# EAGLE board Arduhub_plane (EAGLE 7.3.0)
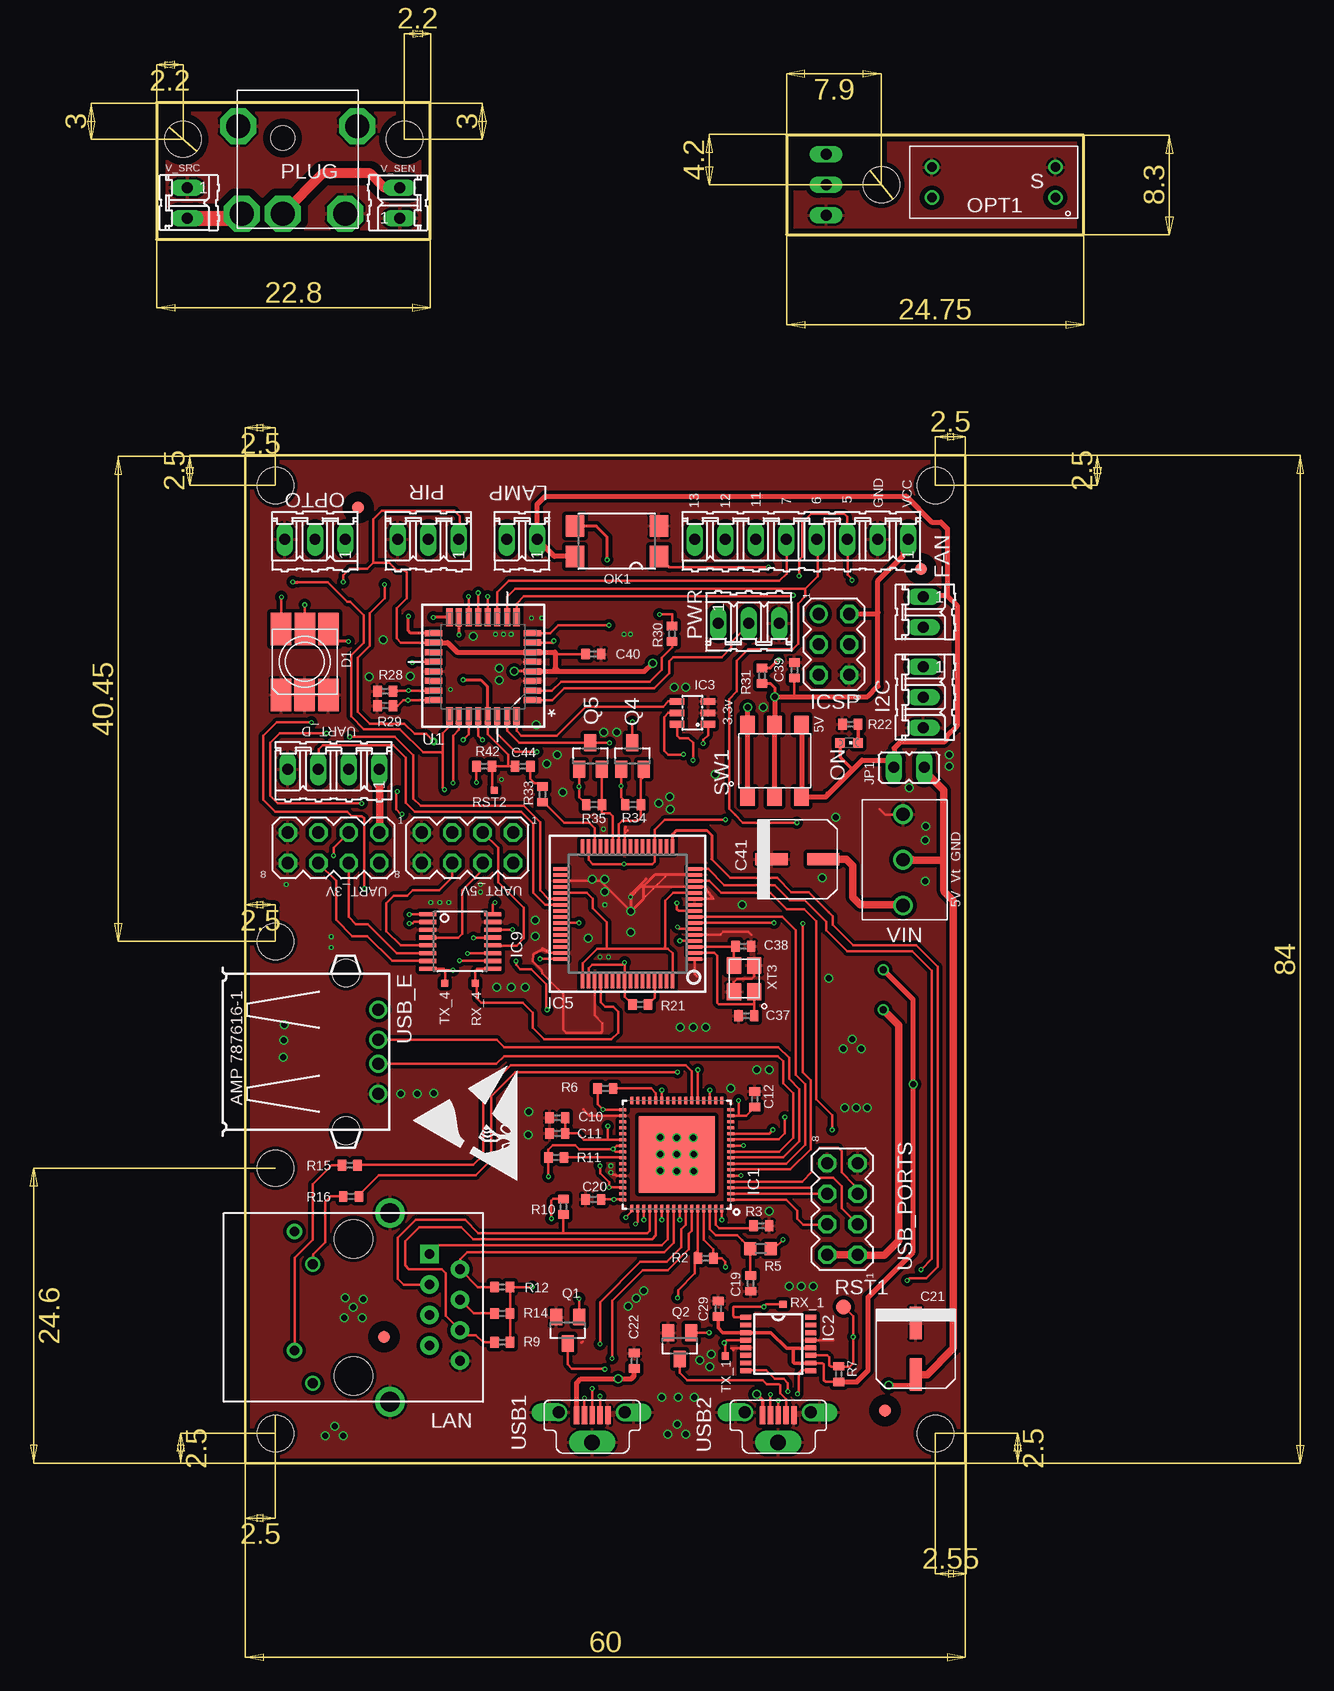
[diagram p3: board, top side]
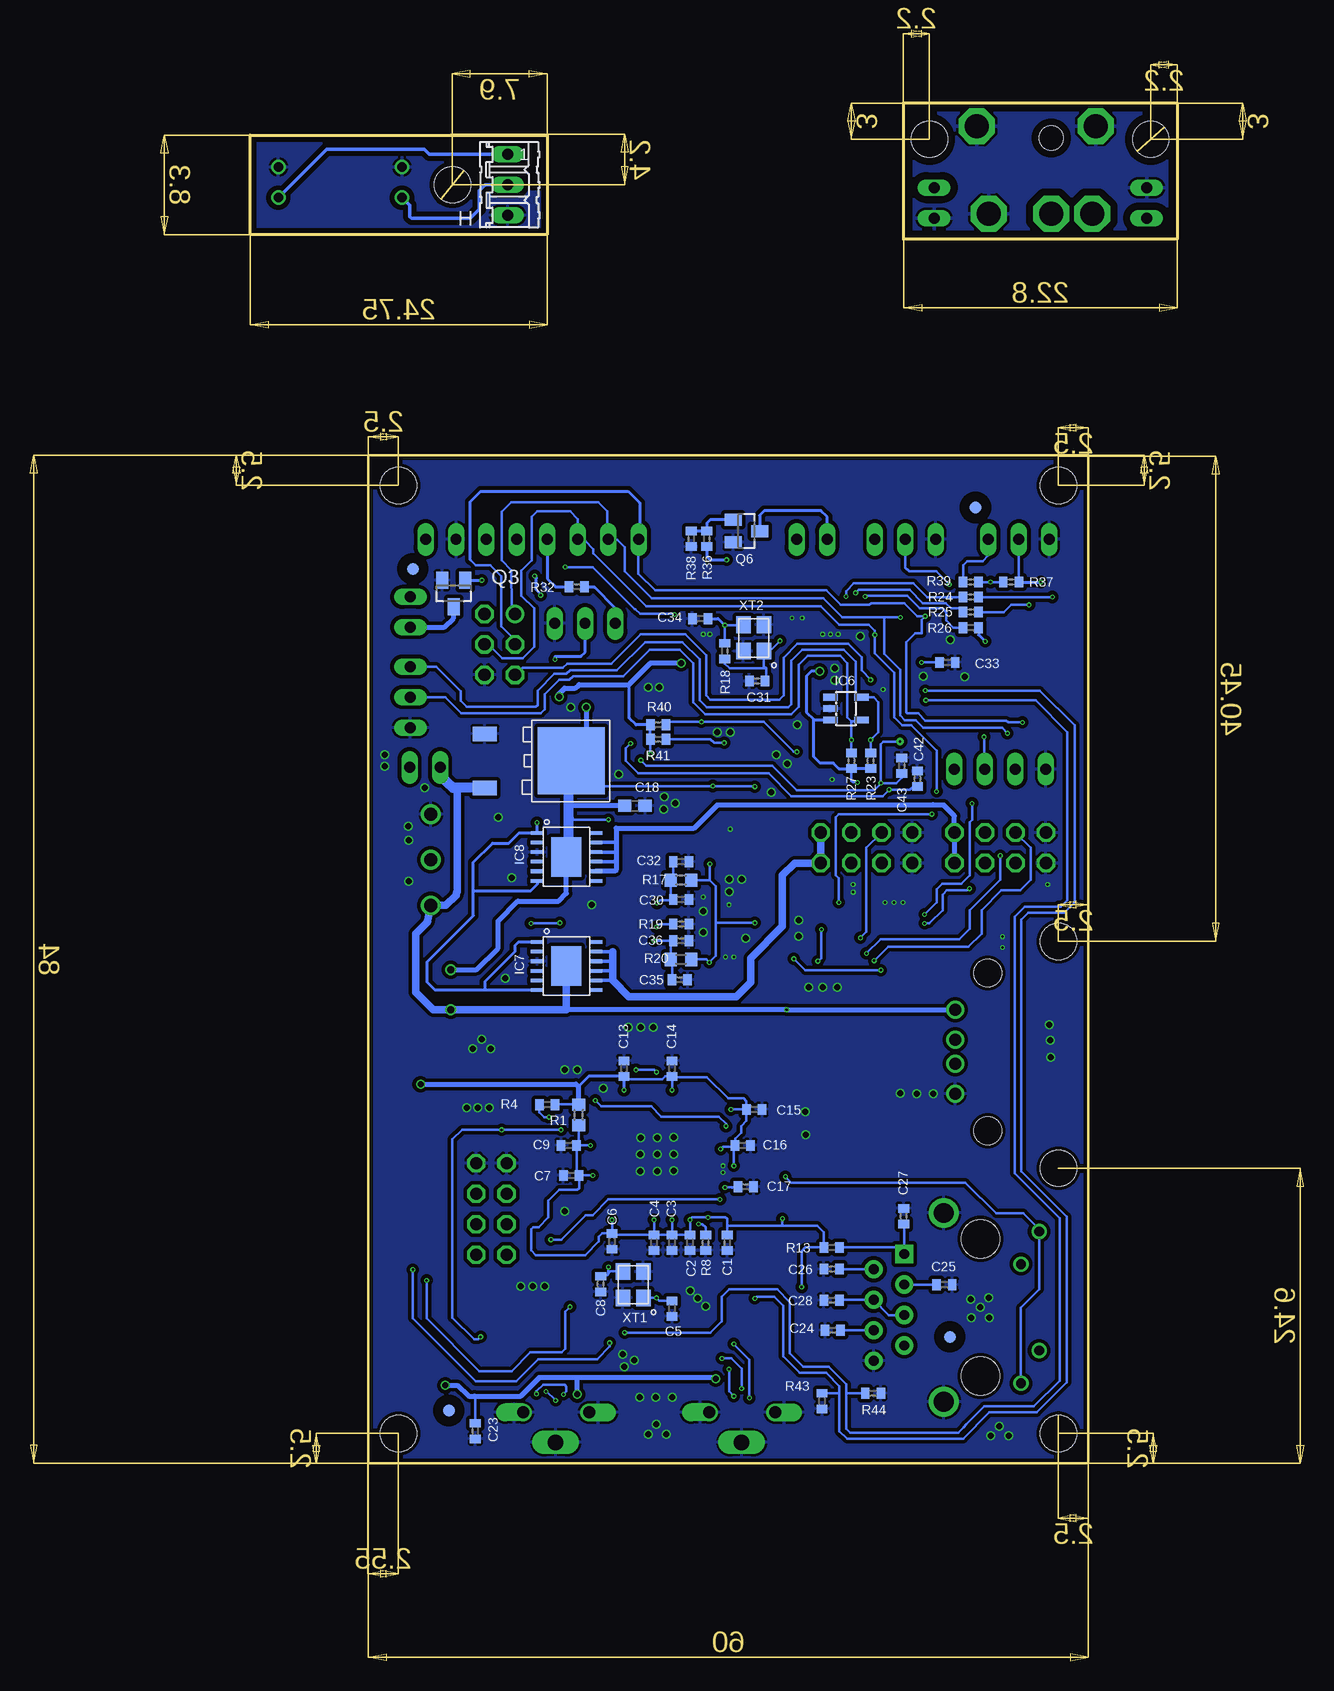
[diagram p4: board, bottom side, seen from below]

Size 77.25 x 113.4 mm. Coordinates in mm from the lower left corner, seen from the top.
Outline: 7.4,84 7.4,0 67.4,0 67.4,84 7.4,84
Outline: 0,113.4 0,102 22.8,102 22.8,113.4 0,113.4
Outline: 52.5,110.7 52.5,102.4 77.25,102.4 77.25,110.7 52.5,110.7
Copper layers (1*16): Top 0.035mm / dielectric 1.5mm / Bottom 0.035mm
Design rules "default *": minimum track width 0.2mm, minimum drill 0.2mm, track to track 0.2mm, track to pad 0.2mm, pad to pad 0.2mm, via to via 0.2mm, smd to smd 0.2mm, copper to edge 0.2mm, drill to drill 0.2mm, minimum pad ring 0.1mm, minimum via ring 0.1mm, stop-mask expansion 0.2mm, vias tented up to drill 0mil, thermal gap 0.2mm
Holes 3 mm at 9.9,24.6 9.9,2.5 9.9,43.5 64.9,2.5 9.9,81.5 64.9,81.5 60.4,106.55 2.2,110.35 20.65,110.35

## Footprints (pad centres in the part's own frame; a part is rotated, then mirrored left to right if it is on the bottom)
C0402 = smd 0.7 x 0.9: 1 -0.65,0; 2 0.65,0
C0603 = smd 1.1 x 1: 1 -0.85,0; 2 0.85,0
MVA_CAP_F55 = smd 1 x 2.7: P$+ 0,2.15; P$- 0,-2.15
PLCC-6 = smd 2.7 x 1.7: 1 -2.75,1.97; 2 -2.75,0.01; 3 -2.75,-1.97; 4 2.75,-1.97; 5 2.75,0; 6 2.75,1.97
02P = drill 0.914 long: 1 -1.27,0; 2 1.27,0
FIDUCIAL_TEST_2C = smd 1 x 1: P$1 0,0 | smd 1 x 1 bottom: P$2 0,0
03P = drill 0.914 long: 1 -2.54,0; 2 0,0; 3 2.54,0
QFN64 = smd 0.6 x 0.25: 1 -4.5,3.75; 2 -4.5,3.25; 3 -4.5,2.75; 4 -4.5,2.25; 5 -4.5,1.75; 6 -4.5,1.25; 7 -4.5,0.75; 8 -4.5,0.25; 9 -4.5,-0.25; 10 -4.5,-0.75; 11 -4.5,-1.25; 12 -4.5,-1.75; 13 -4.5,-2.25; 14 -4.5,-2.75; 15 -4.5,-3.25; 16 -4.5,-3.75; 33 4.5,-3.75; 34 4.5,-3.25; 35 4.5,-2.75; 36 4.5,-2.25; 37 4.5,-1.75; 38 4.5,-1.25; 39 4.5,-0.75; 40 4.5,-0.25; 41 4.5,0.25; 42 4.5,0.75; 43 4.5,1.25; 44 4.5,1.75; 45 4.5,2.25; 46 4.5,2.75; 47 4.5,3.25; 48 4.5,3.75 | smd 0.25 x 0.6: 17 -3.75,-4.5; 18 -3.25,-4.5; 19 -2.75,-4.5; 20 -2.25,-4.5; 21 -1.75,-4.5; 22 -1.25,-4.5; 23 -0.75,-4.5; 24 -0.25,-4.5; 25 0.25,-4.5; 26 0.75,-4.5; 27 1.25,-4.5; 28 1.75,-4.5; 29 2.25,-4.5; 30 2.75,-4.5; 31 3.25,-4.5; 32 3.75,-4.5; 49 3.75,4.5; 50 3.25,4.5; 51 2.75,4.5; 52 2.25,4.5; 53 1.75,4.5; 54 1.25,4.5; 55 0.75,4.5; 56 0.25,4.5; 57 -0.25,4.5; 58 -0.75,4.5; 59 -1.25,4.5; 60 -1.75,4.5; 61 -2.25,4.5; 62 -2.75,4.5; 63 -3.25,4.5; 64 -3.75,4.5 | smd 6.35 x 6.35: GND 0,0
SSOP16 = smd 0.914 x 0.406: 1 -2.718,2.223; 2 -2.718,1.587; 3 -2.718,0.953; 4 -2.718,0.318; 5 -2.718,-0.318; 6 -2.718,-0.953; 7 -2.718,-1.587; 8 -2.718,-2.223; 9 2.718,-2.223; 10 2.718,-1.587; 11 2.718,-0.953; 12 2.718,-0.318; 13 2.718,0.318; 14 2.718,0.953; 15 2.718,1.587; 16 2.718,2.223
SOT-23-6 = smd 0.55 x 1.2: 1 -0.95,-1.3; 2 0,-1.3; 3 0.95,-1.3; 4 0.95,1.3; 5 0,1.3; 6 -0.95,1.3
TO_252_3 = smd 1.2 x 2: 1 -2.25,0; 3 2.25,0 | smd 5.6 x 5.6: TAB 0,7.2
LQFP64 = smd 0.3 x 1.2: 1 -3.75,-5.6; 2 -3.25,-5.6; 3 -2.75,-5.6; 4 -2.25,-5.6; 5 -1.75,-5.6; 6 -1.25,-5.6; 7 -0.75,-5.6; 8 -0.25,-5.6; 9 0.25,-5.6; 10 0.75,-5.6; 11 1.25,-5.6; 12 1.75,-5.6; 13 2.25,-5.6; 14 2.75,-5.6; 15 3.25,-5.6; 16 3.75,-5.6; 33 3.75,5.6; 34 3.25,5.6; 35 2.75,5.6; 36 2.25,5.6; 37 1.75,5.6; 38 1.25,5.6; 39 0.75,5.6; 40 0.25,5.6; 41 -0.25,5.6; 42 -0.75,5.6; 43 -1.25,5.6; 44 -1.75,5.6; 45 -2.25,5.6; 46 -2.75,5.6; 47 -3.25,5.6; 48 -3.75,5.6 | smd 1.2 x 0.3: 17 5.6,-3.75; 18 5.6,-3.25; 19 5.6,-2.75; 20 5.6,-2.25; 21 5.6,-1.75; 22 5.6,-1.25; 23 5.6,-0.75; 24 5.6,-0.25; 25 5.6,0.25; 26 5.6,0.75; 27 5.6,1.25; 28 5.6,1.75; 29 5.6,2.25; 30 5.6,2.75; 31 5.6,3.25; 32 5.6,3.75; 49 -5.6,3.75; 50 -5.6,3.25; 51 -5.6,2.75; 52 -5.6,2.25; 53 -5.6,1.75; 54 -5.6,1.25; 55 -5.6,0.75; 56 -5.6,0.25; 57 -5.6,-0.25; 58 -5.6,-0.75; 59 -5.6,-1.25; 60 -5.6,-1.75; 61 -5.6,-2.25; 62 -5.6,-2.75; 63 -5.6,-3.25; 64 -5.6,-3.75
SOT-23-5 = smd 0.55 x 1.2: 1 -0.95,-1.3; 2 0,-1.3; 3 0.95,-1.3; 4 0.95,1.3; 5 -0.95,1.3
POWERSSO-12 = smd 0.3 x 1.05: 1 -2,-2.45; 2 -1.2,-2.45; 3 -0.4,-2.45; 4 0.4,-2.45; 5 1.2,-2.45; 6 2,-2.45; 7 2,2.45; 8 1.2,2.45; 9 0.4,2.45; 10 -0.4,2.45; 11 -1.2,2.45; 12 -2,2.45 | smd 3.3 x 2.5: TAB 0,0
TSSOP-16 = smd 0.35 x 1.43: 1 -2.275,-2.7; 2 -1.625,-2.7; 3 -0.975,-2.7; 4 -0.325,-2.7; 5 0.325,-2.7; 6 0.975,-2.7; 7 1.625,-2.7; 8 2.275,-2.7; 9 2.275,2.7; 10 1.625,2.7; 11 0.975,2.7; 12 0.325,2.7; 13 -0.325,2.7; 14 -0.975,2.7; 15 -1.625,2.7; 16 -2.275,2.7
MA03-2 = drill 1.016: 1 -2.54,-1.27 | drill 1.016 octagon: 2 -2.54,1.27; 3 0,-1.27; 4 0,1.27; 5 2.54,-1.27; 6 2.54,1.27
JP1 = drill 0.914 long: 1 0,-1.27; 2 0,1.27
J0011D01BNL = drill 0.813 pad 1.524 square: 1 4.445,-6.35 | drill 0.813 pad 1.524: 2 3.175,-8.89; 3 1.905,-6.35; 4 0.635,-8.89; 5 -0.635,-6.35; 6 -1.905,-8.89; 7 -3.175,-6.35; 8 -4.445,-8.89 | drill 1.651 pad 2.159: CHS1 7.87,-3.05; CHS2 -7.87,-3.05 | drill 0.813 pad 1.27: G1 6.325,4.9; G2 3.6,3.38; Y1 -6.325,3.38; Y2 -3.6,4.9 | hole 3.2: 5.715,0; -5.715,0
SMD4 = smd 1.78 x 1.55: 1 -1.27,-3.5; 2 1.27,-3.5; 3 1.27,3.5; 4 -1.27,3.5
LED-603 = smd 0.8 x 0.8: A 0,-0.75; C 0,0.75
ITR9606 = drill 0.8: 1 5.15,-1.27; 2 5.15,1.28; 3 -5.15,1.27; 4 -5.15,-1.27
PJ051A = drill 2 octagon: 1 10.3,-3.4; 2 10.3,5.2; 3 10.3,0; P$1 3,6.2; P$2 3,-3.7 | hole 2: 4,0
SOT-23 = smd 1 x 1.4: 1 -0.95,-1.1; 2 0.95,-1.1; 3 0,1.1
R0603 = smd 1 x 1.1: 1 -0.85,0; 2 0.85,0
R0402 = smd 0.7 x 0.9: 1 -0.65,0; 2 0.65,0
B1,27 = smd 1.27 x 1.27: TP 0,0
TP06SQ = smd 0.6 x 0.6: TP 0,0
08P = drill 0.914 long: 1 -8.89,0; 2 -6.35,0; 3 -3.81,0; 4 -1.27,0; 5 1.27,0; 6 3.81,0; 7 6.35,0; 8 8.89,0
452403012014 = smd 1.2 x 1.5: 1 -2.25,-3; 2 0,-3; 3 2.25,-3; 4 -2.25,3; 5 0,3; 6 2.25,3
QFP80P900X900X120-32N = smd 1.473 x 0.508: 1 -4.115,2.794; 2 -4.115,2.007; 3 -4.115,1.194; 4 -4.115,0.406; 5 -4.115,-0.406; 6 -4.115,-1.194; 7 -4.115,-2.007; 8 -4.115,-2.794; 17 4.115,-2.794; 18 4.115,-2.007; 19 4.115,-1.194; 20 4.115,-0.406; 21 4.115,0.406; 22 4.115,1.194; 23 4.115,2.007; 24 4.115,2.794 | smd 0.508 x 1.473: 9 -2.794,-4.115; 10 -2.007,-4.115; 11 -1.194,-4.115; 12 -0.406,-4.115; 13 0.406,-4.115; 14 1.194,-4.115; 15 2.007,-4.115; 16 2.794,-4.115; 25 2.794,4.115; 26 2.007,4.115; 27 1.194,4.115; 28 0.406,4.115; 29 -0.406,4.115; 30 -1.194,4.115; 31 -2.007,4.115; 32 -2.794,4.115
MA04-2 = drill 1.016 octagon: 1 -3.81,-1.27; 2 -3.81,1.27; 3 -1.27,-1.27; 4 -1.27,1.27; 5 1.27,-1.27; 6 1.27,1.27; 7 3.81,-1.27; 8 3.81,1.27
04P = drill 0.914 long: 1 -3.81,0; 2 -1.27,0; 3 1.27,0; 4 3.81,0
1051330001 = smd 0.45 x 1.5: 1 -1.3,0.75; 2 -0.65,0.75; 3 0,0.75; 4 0.65,0.75; 5 1.3,0.75 | drill 1 pad 1.27 offset: P$1 -2.8,1; P$2 2.7,1 | drill 1.3 pad 1.422 long: P$3 0,-1.5
USB = drill 1: 1 -3.5,12.99; 2 -1,12.99; 3 1,12.99; 4 3.5,12.99 | hole 2.3: -6.57,10.28; 6.57,10.28
MOLEX_39357-3 = drill 1.1: P$1 -3.8,0; P$2 0,0; P$3 3.8,0
ABM8G = smd 1.4 x 1.2: 1 -1.1,-0.85; 2 1.1,-0.85; 3 1.1,0.85; 4 -1.1,0.85

## Placement (x,y rotation side)
C1  100nF  [C0402]  37.5,18.4 270 bottom
C2  100nF  [C0402]  40.6,18.4 270 bottom
C3  100nF  [C0402]  42.1,18.4 270 bottom
C4  100nF  [C0402]  43.6,18.4 270 bottom
C5  33pF  [C0402]  42.1,12.9 270 bottom
C6  100nF  [C0402]  47.1,18.5 270 bottom
C7  100nF  [C0402]  50.5,24 180 bottom
C8  33pF  [C0402]  48.05,14.95 270 bottom
C9  100nF  [C0402]  50.7,26.5 180 bottom
C10  4.7uF  [C0402]  33.4,28.8 180 top
C11  100nF  [C0402]  33.4,27.5 180 top
C12  100nF  [C0402]  49.85,30.35 90 top
C13  100nF  [C0402]  46.1,32.9 90 bottom
C14  100nF  [C0402]  42.1,32.9 90 bottom
C15  100nF  [C0402]  35.25,29.5 0 bottom
C16  100nF  [C0402]  36.2,26.5 0 bottom
C17  100nF  [C0402]  35.95,23.05 0 bottom
C18  100uF  [C0603]  45.2,54.8 0 bottom
C19  1uF  [C0402]  49.5,15 270 top
C20  100nF  [C0402]  36.4,22 180 top
C21  150uF  [MVA_CAP_F55]  63.25,9.55 180 top
C22  100nF  [C0402]  39.8,8.55 90 top
C23  100nF  [C0402]  58.5,2.7 270 bottom
C24  15pF  [C0402]  28.7,11.1 180 bottom
C25  15pF  [C0402]  19.4,14.9 0 bottom
C26  15pF  [C0402]  28.8,16.2 180 bottom
C27  15pF  [C0402]  22.8,20.6 90 bottom
C28  22nF  [C0402]  28.8,13.6 180 bottom
C29  100nF  [C0402]  46.8,12.9 90 top
C30  4.7uF  [C0402]  41.35,47 0 bottom
C31  22pF  [C0402]  35,65.2 180 bottom
C32  100nF  [C0402]  41.35,50.15 0 bottom
C33  100nF  [C0402]  19.15,66.75 180 bottom
C34  22pF  [C0402]  39.75,70.4 180 bottom
C35  4.7uF  [C0402]  41.45,40.3 0 bottom
C36  100nF  [C0402]  41.35,43.55 0 bottom
C37  27pF  [C0402]  49.15,37.3 180 top
C38  27pF  [C0402]  48.9,43.1 0 top
C39  1uF  [C0402]  53.15,66.1 90 top
C40  100nF  [C0402]  36.4,67.45 0 top
C41  150uF  [MVA_CAP_F55]  53.4,50.35 270 top
C42  100nF  [C0402]  21.65,57.05 90 bottom
C43  100nF  [C0402]  22.95,58.15 90 bottom
C44  100nF  [C0402]  30.5,58.1 180 top
D1  SLV6A-FKB  [PLCC-6]  12.35,66.8 90 top
FAN  [02P]  63.9,70.95 270 top
FIDUCIAL1  FIDU_2C  [FIDUCIAL_TEST_2C]  18.95,10.55 0 top
FIDUCIAL2  FIDU_2C  [FIDUCIAL_TEST_2C]  60.7,4.4 0 top
FIDUCIAL3  FIDU_2C  [FIDUCIAL_TEST_2C]  16.8,79.65 0 top
FIDUCIAL4  FIDU_2C  [FIDUCIAL_TEST_2C]  63.7,74.55 0 top
H  [03P]  55.8,106.55 270 bottom
I2C  [03P]  63.9,63.85 270 top
IC1  LAN9514  [QFN64]  43.35,25.74 180 top
IC2  FT230XS  [SSOP16]  51.8,9.95 0 top
IC3  SN74LVC1G332DBVR  [SOT-23-6]  44.65,62.55 90 top
IC4  AP1084D  [TO_252_3]  57.7,58.55 270 bottom
IC5  FT4232HL  [LQFP64]  39.25,45.8 90 top
IC6  TC74  [SOT-23-5]  27.6,62.9 270 bottom
IC7  VND7140AJ12TR  [POWERSSO-12]  50.9,41.45 270 bottom
IC8  VND7140AJ12TR  [POWERSSO-12]  50.9,50.55 270 bottom
IC9  MUX509IPWR  [TSSOP-16]  25.3,43.5 270 top
ICSP  [MA03-2]  56.45,68.25 270 top
JP1  [JP1]  62.7,58 90 top
LAMP  [02P]  30.45,77 180 top
LAN  J0011D01BNL  [J0011D01BNL]  16.4,13 90 top
OK1  LTV816S  [SMD4]  38.35,76.85 90 top
ON  [LED-603]  57.7,60.05 270 top
OPT1  ITR9606  [ITR9606]  69.75,106.75 0 top
OPTO  [03P]  13.2,77 180 top
PIR  [03P]  22.65,77 180 top
PLUG  PJ051A  [PJ051A]  10.5,114.45 270 top
PWR  [03P]  49.35,70 0 top
Q1  [SOT-23]  34.25,11.1 180 top
Q2  [SOT-23]  43.6,9.8 180 top
Q3  [SOT-23]  60.3,72.5 180 bottom
Q4  [SOT-23]  39.65,58.95 0 top
Q5  [SOT-23]  36.15,58.95 0 top
Q6  [SOT-23]  35.9,77.7 270 bottom
R1  [R0603]  49.88,29.05 90 bottom
R2  1M  [R0402]  45.75,17.1 0 top
R3  12k  [R0402]  50.4,19.8 180 top
R4  1k  [R0402]  52.5,29.9 0 bottom
R5  [R0603]  50.34,17.9 0 top
R6  10k  [R0402]  37.4,31.25 0 top
R7  10k  [R0402]  56.85,7.45 270 top
R8  12.4k  [R0402]  39.3,18.4 90 bottom
R9  49.9  [R0402]  28.8,10.1 0 top
R10  49.9  [R0402]  33.9,21.4 90 top
R11  10k  [R0402]  33.3,25.5 180 top
R12  49.9  [R0402]  28.8,14.7 0 top
R13  49.9  [R0402]  28.8,18 180 bottom
R14  10  [R0402]  28.8,12.5 0 top
R15  1k  [R0402]  16.1,24.85 0 top
R16  1k  [R0402]  16.2,22.25 0 top
R17  [R0603]  41.35,48.6 0 bottom
R18  1M  [R0402]  37.7,67.7 90 bottom
R19  12k  [R0402]  41.35,44.95 180 bottom
R20  [R0603]  41.35,42 0 bottom
R21  10k  [R0402]  40.3,38.25 0 top
R22  1k  [R0402]  57.8,61.6 0 top
R23  10k  [R0402]  25.55,58.55 90 bottom
R24  1k  [R0402]  17.2,72.2 0 bottom
R25  1k  [R0402]  17.2,70.95 0 bottom
R26  1k  [R0402]  17.2,69.65 0 bottom
R27  10k  [R0402]  27.15,58.55 90 bottom
R28  10k  [R0402]  19.05,64.35 180 top
R29  10k  [R0402]  19.05,63.15 180 top
R30  1k  [R0402]  42.95,69.15 270 top
R31  10k  [R0402]  50.45,65.65 90 top
R32  220  [R0402]  50.05,73.05 180 bottom
R33  0  [R0402]  32.15,55.75 90 top
R34  10k  [R0402]  39.7,54.9 0 top
R35  10k  [R0402]  36.45,54.9 0 top
R36  220  [R0402]  39.2,77.05 270 bottom
R37  10k  [R0402]  13.85,73.45 0 bottom
R38  10k  [R0402]  40.5,77.05 90 bottom
R39  220  [R0402]  17.2,73.45 0 bottom
R40  10k  [R0402]  43.25,61.55 0 bottom
R41  10k  [R0402]  43.25,60.35 0 bottom
R42  10k  [R0402]  27.3,58.1 0 top
R43  10k  [R0402]  29.6,5.2 90 bottom
R44  10k  [R0402]  25.35,5.85 180 bottom
RST1  PTR1B1,27  [B1,27]  57.25,13.05 0 top
RST2  PTR1TP06SQ  [TP06SQ]  28.15,56.1 0 top
RX_1  PTR1TP06SQ  [TP06SQ]  52.2,13.25 0 top
RX_4  TPTP06SQ  [TP06SQ]  26.55,40 0 top
SL6  [08P]  53.75,77 180 top
SW1  452403012014  [452403012014]  51.5,58.55 0 top
TX_1  PTR1TP06SQ  [TP06SQ]  47.4,8.95 0 top
TX_4  TPTP06SQ  [TP06SQ]  24,40 0 top
U1  ATMEGA328P-AU  [QFP80P900X900X120-32N]  27.2,66.4 180 top
U$1  [A4L-LOC]  -88.3,-45.9 0 top  (outside the outline)
U$3  [STATIC]  30.15,23.5 90 top
UART_3V  [MA04-2]  14.75,51.3 180 top
UART_5V  [MA04-2]  25.9,51.3 180 top
UART_D  [04P]  14.75,57.85 180 top
USB1  1051330001  [1051330001]  36.3,3.25 0 top
USB2  1051330001  [1051330001]  51.8,3.25 0 top
USB_E  [USB]  5.5,34.3 270 top
USB_PORTS  [MA04-2]  57.15,21.2 90 top
V_SEN  [02P]  20.25,105.05 90 top
V_SRC  [02P]  2.55,105.05 270 top
VIN  MOLEX_39357_3  [MOLEX_39357-3]  62.2,50.3 90 top
XT1  25MHz  [ABM8G]  45.34,14.89 90 bottom
XT2  ABM8G  [ABM8G]  35.3,68.8 90 bottom
XT3  ABM8G  [ABM8G]  48.95,40.4 90 top

## Tracks (layer width: path | path; a pad name or v marks a point on that pad's centre or on a via)
1V8CORE  (via drill 0.2)
  Top 0.2: C10.1 C11.1 35.1,27.5 35.61,26.99 37.59,26.99 | IC1.15 48.5,28.99 | 37.59,26.99 37.6,27 v37.6,28.1 | v48.5,30.25 48.5,28.99 | 48.5,28.99 49.14,28.99 C12.1 | IC1.38 37.59,26.99
  Bottom 0.2: v37.6,28.1 37.6,28.3 38.2,28.9 43,28.9 43.85,29.75 48,29.75 v48.5,30.25
3V3_A  (via drill 0.2)
  Top 0.2: IC1.51 v40.6,20.3 | IC1.54 v42.1,20.3 | IC1.57 v43.6,20.3 | IC1.5 v48.69,23.99 v48.7,24 | IC1.64 v47.1,20.3 | R9.2 R14.2 R12.2 v31.3,14.7 | R10.2 33.05,22.05 32.9,21.9 v32.9,20.4 | IC1.10 48.84,26.49 v48.9,26.5 | IC1.49 39.6,21 v39.1,20.5
  Bottom 0.2: v47.1,20.3 C6.1 | C9.1 49.88,26.53 R1.1 | v48.9,26.5 C9.1 | C7.1 49.85,22.95 50,22.8 51.5,22.8 52.4,21.9 52.4,20.5 53.2,19.7 53.65,19.7 53.85,19.5 53.85,17.75 53.45,17.35 49.35,17.35 48.2,18.5 48.2,18.9 47.9,19.2 47.15,19.2 C6.1 | C4.1 47,19.05 C6.1 | C3.1 C4.1 | C3.1 C2.1 v40.6,20.3 40.4,20.5 v39.1,20.5 37.65,20.5 37.5,20.4 37.5,19.8 | v43.6,20.3 C4.1 | v42.1,20.3 C3.1 | v48.7,24 C7.1 | 32.9,19.8 30,19.8 29.45,19.25 R13.2 31,18 31.3,17.7 v31.3,14.7 | 32.9,19.8 37.5,19.8 | 37.5,19.8 C1.1 | v32.9,20.4 32.9,19.8 | C9.1 50.05,24.2 C7.1
3V_UART
  Top 0.61: UART_D.1 18.56,56.26 18.6,56.25 18.6,53.88 UART_3V.1
  Bottom 0.305: IC8.9 46.85,50.15 46.75,50.25 | IC8.10 46.75,50.95 | IC8.11 46.75,51.75
  Bottom 0.406: 20.3,54.85 19.45,54.85 18.56,53.96 UART_3V.1 UART_3V.2 | 20.3,54.85 38.35,54.85 40.25,52.95 46.75,52.95 46.75,51.75 46.75,50.95 46.75,50.25 46.75,49.45 46.85,49.35 IC8.8 | 20.35,54.9 20.3,54.85
5V_UART
  Bottom 0.305: IC7.11 47.05,42.65 | IC7.10 47.05,41.85 | IC7.9 47.1,41.05 47.05,41.1 | IC7.8 47.05,40.25
  Bottom 0.61: UART_5V.1 UART_5V.2 31.87,50.03 32.9,49 32.9,44.75 35.55,42.1 35.55,40.1 36.75,38.9 45.7,38.9 47.05,40.25 47.05,41.1 47.05,41.85 47.05,42.65
+3V3  (via drill 0.2, 0.5, 0.6)
  Top 0.2: IC1.33 v37.2,29.49 36.75,29.94 R6.1 | IC1.27 v42.1,31.1 | IC1.19 v46.1,31.1 | v32.65,23.9 R11.2 32.65,26.15 33,26.5 34.9,26.5 35.2,26.2 v38.05,26.2 | IC2.10 55.49,8.36 55.6,8.25 55.6,6.95 55.75,6.8 R7.2 | IC5.31 36,50.3 36.35,49.95 v38.95,49.95 41.3,49.95 41.5,50.15 IC5.20 41.5,52.8 42.35,53.65 v47.4,53.65 | IC5.42 v35.2,45.05 | R21.1 39,38.9 IC5.56 v39,41.75 38.8,41.55 36.3,41.55 36,41.25 IC5.50 | 39.05,57.5 Q4.1 v38.7,56.45 38.7,55.5 39.05,55.15 R34.1 | R35.1 35.2,55.5 v35.2,56.4 Q5.1 | IC1.40 38.26,25.99 v38.05,26.2 | IC1.39 38.34,26.49 v38.05,26.2 | v36.95,24.8 36.95,24.2 37.7,23.45 v37.7,23 IC1.46
  Top 0.305: 53,9.6 52.5,9.6 51.2,10.9 IC2.3 47.2,10.9 46.8,11.3 C29.1 | IC2.12 54.48,9.6 53,9.6 | IC2.10 53.14,8.36 53.05,8.45 53.05,9.55 53,9.6
  Top 0.406: R7.2 58.35,6.8 59.3,7.75 59.3,13.85 63.05,17.6 v63.05,31.6 63.05,38.65 v60.55,41.15 | v49.25,63 SW1.4 SW1.1
  Bottom 0.2: 37.06,22.99 C17.1 36.65,23 v37.7,23 | R1.2 49.88,30.2 | 36.95,26.4 C16.1 | 36.9,26.55 C16.1 | C14.1 42.05,32.2 39.2,32.2 37.42,30.43 36.12,30.43 35.9,30.2 C15.1 | v42.1,31.1 C14.1 | LAN.Y1 13.02,12.98 11.5,14.5 LAN.G1 11.5,19.5 12.85,20.85 15.1,20.85 17.65,23.4 32.15,23.4 v32.65,23.9 | C14.1 42.65,32.25 42.9,32 45.85,32 C13.1 | 36.95,26.4 v36.95,24.8 | R20.2 39.25,42 v39,41.75 38.45,42.3 38.45,45.1 | v38.95,49.95 38.95,48.6 | 38.95,48.6 R17.2 | 38.95,48.6 38.45,48.1 38.45,45.1 | v35.2,45.05 38.4,45.05 38.45,45.1 | v35.2,56.4 35.25,56.45 v38.7,56.45 47.9,56.45 49.6,58.15 | v47.4,53.65 50.6,53.65 50.7,53.75 | 36.95,26.4 37.85,26.4 v38.05,26.2 | C16.1 36.85,27.05 36.35,27.55 36.35,28.1 35.9,28.55 C15.1 | 49.9,29.92 51.83,29.92 R4.2 | C15.1 v37.19,29.5 v37.2,29.49
  Bottom 0.254: 49.9,31.4 49.05,32.25 C13.1 v46.1,31.1
  Bottom 0.406: v60.55,41.15 58.4,41.15 56.6,42.95 56.6,45.2 54.95,46.85 51.55,46.85 50.9,47.5 IC8.TAB | v49.25,63 49.25,58.5 49.6,58.15 IC4.TAB | v63.05,31.6 50.1,31.6 49.9,31.4 49.9,29.92 R1.2 | C18.1 50.7,54.8
  Bottom 0.813: IC8.TAB 50.7,50.75 50.7,53.75 50.7,54.8 50.7,57.05 IC4.TAB
+5V  (via drill 0.2, 0.6)
  Top 0.2: 55.85,55.9 55.98,55.77 | IC9.14 29.62,44.48 v29.65,44.5 | v29.95,41.85 29.95,41.55 30.3,41.2 31.2,41.2 32.45,39.95 32.45,37.95 v32.55,37.8
  Top 0.305: ON.A 56.95,58.85 58,57.8
  Top 0.406: SW1.6 SW1.3 55.75,55.55 55.98,55.77 58,57.8 58.8,58.6 61.33,58.6 JP1.2 61.45,58.62 61.45,59.6 61.95,60.1 65.6,60.1 65.85,60.35 65.85,60.6 66.7,61.45 66.7,71.5 65.9,72.3 65.75,72.3 | OK1.4 33.14,75.58 LAMP.1 31.72,79.92 32.4,80.6 62.45,80.6 64.6,78.45 65.35,78.45 65.9,77.9 65.9,72.45 65.75,72.3 | 65.75,72.3 63.98,72.3 FAN.1
  Top 0.61: v60.55,37.8 61.85,36.5 61.85,18.55 60.65,17.35 58.46,17.35 USB_PORTS.1 USB_PORTS.2 | C41.P$+ 57.45,50.35 58,49.8 58,47.2 58.65,46.55 62.15,46.55 VIN.P$1
  Bottom 0.2: v29.65,44.5 29.65,42.1 29.9,41.85 v29.95,41.85
  Bottom 0.406: USB_E.1 v32.55,37.8 50.9,37.8
  Bottom 0.61: IC7.TAB 50.9,37.8 v60.55,37.8 61.87,37.8 arc45 62.09,37.89 63.45,39.25 63.45,44.15 62.54,45.06 arc-45 62.45,45.28 VIN.P$1 60.95,46.5 60.09,47.36 60.09,47.51 arc-45 60,47.73 60,56.15 61.29,57.19 arc45 61.38,57.41 JP1.2
  Bottom 0.813: IC4.3 60.35,56.3 61.29,57.19
+5V/1  (via drill 0.5)
  Top 0.305: USB2.1 50.5,5.25 v50,5.75
  Top 0.406: C22.1 39.8,7.3 39.55,7.05 v38.45,7.05 35.35,7.05 35,6.7 USB1.1 | v61,6.5 63.3,6.5 63.35,6.55 63.35,7.3 C21.P$+
  Top 0.61: VIN.P$2 62.82,50.35 arc-45 63.04,50.26 65.38,50.26 arc45 65.6,50.35 | C21.P$+ 64.2,7.4 66.31,9.51 arc45 66.4,9.73 66.4,46.9 65.69,47.61 arc-45 65.6,47.83 65.6,50.35 | 65.6,50.35 65.6,56.1 64.04,57.66 arc-45 63.95,57.88 63.95,58.48 arc45 JP1.1
  Bottom 0.2: C23.1 58.5,5.5 58.55,5.6
  Bottom 0.305: 50,6.95 49.85,7.15
  Bottom 0.406: v38.45,7.05 38.6,7.05 38.6,7.15 49.85,7.15 53.2,7.15 53.2,7.1 54.7,5.6 58.55,5.6 59.05,5.6 60,6.5 v61,6.5 | v50,5.75 50,6.95
A0  (via drill 0.2)
  Top 0.2: U1.23 v21.01,64.39 | v21.01,64.39 v21,64.4 | v35.2,13.75 Q1.1 | v21.01,64.39 19.54,64.39 20.05,64.35 R28.1
  Bottom 0.2: v21,64.4 11.45,64.4 8.55,61.5 8.55,46.75 9.4,45.9 12.4,45.9 13,45.3 13,24.35 9.2,20.55 9.2,6.75 11.7,4.25 15.65,4.25 17.85,2.05 27.5,2.05 28.15,2.7 28.15,5.85 | 28.15,5.85 28.15,6.45 29.25,7.55 31.45,7.55 32.85,8.95 32.85,13.15 33.6,13.9 35.05,13.9 v35.2,13.75 | R43.2 28.15,5.85
A1  (via drill 0.2)
  Top 0.2: U1.24 21.51,63.61 | 21.51,63.61 v20.95,63.6 | v46.05,10.9 Q2.1 | 21.51,63.61 20.56,63.61 20.1,63.15 R29.1
  Bottom 0.2: v20.95,63.6 11.8,63.6 9.15,60.95 9.15,46.95 9.7,46.4 12.7,46.4 13.55,45.55 13.55,24.2 9.8,20.45 9.8,6.9 11.95,4.75 16.1,4.75 17.6,3.25 17.8,3 18.25,2.55 27.25,2.55 27.6,2.9 27.6,5.65 27.6,5.85 | 27.6,5.85 27.6,6.6 29.05,8.05 31.15,8.05 32.3,9.2 32.3,13.45 33.35,14.5 37.35,14.5 37.95,13.9 37.95,11.85 38.9,10.9 v46.05,10.9 | R44.2 27.6,5.85
A2  (via drill 0.2)
  Top 0.2: U1.25 24.41,61.41 23.85,60.85 23.85,59.15 | 23.85,59.15 23.85,56.3 v24,56.15 | 45.55,61.45 IC3.1 45.95,60.7 45.55,60.3 v45.55,60 | 11.75,73.45 14.25,73.45 15.9,71.8 16.15,71.8 17.25,70.7 17.25,68.4 16.2,67.35 16.2,62.25 17.25,61.2 20.25,61.2 22.2,59.25 23.75,59.25 23.85,59.15
  Top 0.254: v11.35,73.45 11.75,73.45
  Bottom 0.2: v45.55,60 45.95,59.6 45.95,58.55 44.9,57.5 34.05,57.5 32.15,55.6 24.55,55.6 v24,56.15 22.3,56.15 22,56.4 C42.1 | OPTO.2 R37.2
  Bottom 0.254: R37.2 v11.35,73.45
A3  (via drill 0.2, 0.2 pad 0.61)
  Top 0.2: U1.26 25.19,61.14 24.7,60.65 v24.7,56.7 | v44.7,58.6 44.7,60.05 44.3,60.45 43.6,60.45 43.4,60.65 43.4,61.55 IC3.6 | v19,73.25 19,72.1 17.75,70.85 17.75,68.15 16.75,67.15 16.75,62.65 17.75,61.65 20.65,61.65 21.5,60.8 22.45,60.8 v23.1,60.15
  Bottom 0.2: v24.7,56.7 24.7,56.65 25.25,56.1 31.7,56.1 33.75,58.15 44.25,58.15 v44.7,58.6 | C43.1 22.95,57.15 23.4,56.7 v24.7,56.7 | PIR.2 22.65,74.65 22.35,74.35 20.1,74.35 v19,73.25 | v23.1,60.15 24.5,60.15 24.7,59.95 v24.7,56.7
D2
  Top 0.2: U1.32 29.99,61.06 30.4,60.65 33.35,60.65 35.75,63.05 42.2,63.05 42.65,63.5 IC3.4
D3  (via drill 0.2)
  Top 0.2: U1.1 32.96,63.61 33.95,64.6 41.45,64.6 42.7,65.85 42.7,66.85 43.05,67.2 47.1,67.2 47.9,68 47.9,68.45 49.35,69.9
  Top 0.254: PWR.2 49.35,69.9 | R31.2 51.15,66.3 v51.85,67
  Bottom 0.254: v51.85,67 51.85,67.25 49.7,67.25 49.35,67.6 PWR.2
D4
  Top 0.2: U1.2 32.94,64.39 33.7,65.15 41.1,65.15 42.1,66.15 42.1,67.15 42.95,68 R30.2
  Top 0.254: 42.9,68.45 R30.2
D5  (via drill 0.2)
  Top 0.2: U1.9 29.99,71.34 29.99,71.64 30.6,72.25 52.95,72.25 v53.05,72.35 | 57.6,76.95 57.6,74.05 57.95,73.7 | 57.6,76.95 57.6,76.99 | v53.55,73.95 53.55,75.3 53.8,75.55 53.8,78.4 54.55,79.15 57.3,79.15 57.55,78.9 SL6.3 57.6,76.95
  Top 0.254: v57.95,73.6 57.95,73.7
  Bottom 0.254: Q3.1 v57.95,73.6 | v53.05,72.35 53.05,72.45 53.4,72.8 53.4,73.8 v53.55,73.95
D6  (via drill 0.2)
  Top 0.2: U1.10 29.21,72.21 29.9,72.9 54.05,72.9 | 54.05,72.9 55.1,73.95 55.1,76.95 55.07,76.95 SL6.4 | 54.05,72.9 54.05,72.25 53.45,71.65 53.45,68.3 53,67.85 49.3,67.85 48.35,66.9 48.35,64.35 47.7,63.7 47.7,54.55 48.2,54.05 48.85,53.4 v53.35,53.4
  Bottom 0.254: IC7.6 57.7,39.45 | 57.7,39.45 61.85,39.45 62.5,40.1 62.5,41.8 58.65,45.65 58.65,47.75 | 58.65,47.75 58.65,50.1 57.05,51.7 55.7,51.7 54.85,52.55 IC8.1 v53.35,53.4 | IC8.6 53.35,48.25 53.9,47.7 58.6,47.7 58.65,47.75 | IC7.1 54.9,43.45 55.2,43.15 55.2,42.65 57.7,40.15 57.7,39.45
D7
  Top 0.2: U1.11 28.39,72.59 29.35,73.55 51.9,73.55 52.5,74.15 52.5,76.99 SL6.5
  Bottom 0.254: SL6.5 52.48,73.73 51.8,73.05 R32.2
D8  (via drill 0.2)
  Top 0.2: v27.6,72.25 27.6,70.52 U1.12
  Bottom 0.2: R24.1 20.85,72.2 22,73.35 26.95,73.35 27.6,72.7 v27.6,72.25
D9  (via drill 0.2)
  Top 0.2: v26.8,72.55 26.8,70.52 U1.13
  Bottom 0.2: v26.8,72.55 26.55,72.8 22.3,72.8 21.2,71.7 19.3,71.7 18.85,71.25 17.95,71.25 17.85,71.15 R25.1
D10  (via drill 0.2)
  Top 0.2: v26,72.25 26,70.52 U1.14
  Bottom 0.2: v26,72.25 25.95,72.3 22.5,72.3 21.45,71.25 19.55,71.25 19.25,70.95 19.25,70.25 18.65,69.65 R26.1
D11  (via drill 0.2)
  Top 0.2: IC9.16 28,46.55 v28.2,46.75 | v20.45,54.1 20.35,54.1 19.95,54.5 19.95,55.9 v20.05,56
  Top 0.254: U1.15 25.19,69.26 v25.2,69.05
  Bottom 0.2: ICSP.4 57.37,68.22 56.25,67.1 54.55,67.1 53.6,68.05 53.6,71.25 54.65,72.3 54.65,74.4 53.8,75.25 53.8,78.9 53.35,79.35 50.6,79.35 49.94,78.69 SL6.6 49.85,76.91 49.85,76.88 49.33,76.88 48.65,76.2 48.65,75.85 44.25,71.45 29.7,71.45 28.15,69.9 25.7,69.9 25.2,69.4 v25.2,69.05 25.2,67.5 23.6,65.9 23.6,62.2 22.9,61.5 22.15,61.5 20.05,59.4 v20.05,56 | v28.2,46.75 28.2,48.75 28.45,49 28.45,53.85 28.2,54.1 v20.45,54.1
D12  (via drill 0.2)
  Top 0.2: v14.15,60.85 10.25,60.85 9.45,60.05 9.45,55.65 10.1,55 v17.1,55 | v21.05,45.75 22.58,45.75 IC9.1
  Top 0.254: U1.16 23.06,70.52 v23.05,70.5
  Bottom 0.2: 47.5,77.1 47.5,79.35 48.25,80.1 55.5,80.1 56.3,79.3 56.3,75.25 55.48,74.43 55.45,71.4 | ICSP.1 55.18,71.13 | v14.15,60.85 14.6,61.3 21.15,61.3 21.8,61.95 22.7,61.95 23.1,62.35 23.1,66.15 24.41,67.46 U1.16 24.39,70.5 v23.05,70.5 27.9,70.5 29.5,72.1 43.8,72.1 46.05,74.35 46.05,76.35 46.68,76.98 47.35,76.98 47.37,77 SL6.7 | v17.1,55 17.1,53.65 17.3,53.45 17.3,49 18,48.3 19.6,48.3 20.05,47.85 20.05,46.75 v21.05,45.75
  Bottom 0.254: 47.5,77.1 SL6.7 | 47.45,76.98 47.35,76.98 | 55.18,71.13 55.45,71.4
D13  (via drill 0.2)
  Top 0.2: IC9.2 21.48,45.12 21.35,45 v21.05,45 | v17.3,47.9 17.3,53.75 17.1,53.95 16.25,53.95 15.9,54.3 9.9,54.3 8.9,55.3 8.9,60.65 10,61.75 v12.9,61.75
  Top 0.254: U1.17 21.16,69.19 20.95,69.4 20.95,70.55 v21,70.6
  Bottom 0.2: 58.9,75.3 58.45,74.85 57.25,74.85 56.35,73.95 56.35,69.75 55.18,68.58 | v21.05,45 20.65,45 19.55,46.1 19.55,47.4 19.2,47.75 17.55,47.75 v17.3,47.9 | v12.9,61.75 14.1,61.75 14.25,61.9 21,61.9 21.6,62.5 22.5,62.5 22.6,62.6 22.6,68.44 21.85,69.19 21.3,69.19 21.3,70.3 v21,70.6 21.65,70.6 22.75,71.7 25.5,71.7 25.65,71.55 28.05,71.55 29.25,72.75 43.5,72.75 44.9,74.15 44.9,76.99 44.89,77 SL6.8
  Bottom 0.254: 58.9,75.3 58.9,80.15 58.05,81 45.75,81 44.8,80.05 44.8,77.06 SL6.8 | ICSP.3 55.18,68.58
DTR_ARD
  Top 0.2: IC5.30 36.5,52.95 36.05,53.4 33.95,53.4 32.25,55.1 R33.1
ETH_PLL  (via drill 0.2)
  Top 0.2: C20.1 v38.1,22 IC1.48 | R5.2 51.46,17.91 v52.2,18.65
  Bottom 0.2: v52.2,18.65 51.35,18.65 49.3,20.7 48.7,20.7 47.4,22 v38.1,22
FTDI_VCORE
  Top 0.2: IC5.49 35.5,41.7 36.7,42.9 37.45,42.9 | IC5.37 35.85,47.55 36.35,47.05 36.35,46.25 37.5,45.1 37.5,42.95 37.45,42.9 | IC5.64 43,42.5 42.6,42.9 42.25,42.9 | 42.25,42.9 37.45,42.9 | IC5.12 43.05,47.55 42.4,46.9 42.4,43.05 42.25,42.9
GND  (via drill 0.2, 0.5)
  Top 0.2: IC1.34 36.06,28.99 35.55,29.5 | 35.5,10.15 35.4,10.05 | 48.05,9.45 47.9,9.6 49.05,9.6 IC2.5 | IC2.13 56.37,10.27 56.4,10.3 | XT3.4 48.1,40.1 48.4,40.4 49.6,40.4 49.8,40.6 XT3.2 | 32.8,42.55 32.15,42.95 | 36.5,38.95 IC5.51 36.5,37.35 37.15,36.7 37.15,36 37.05,35.9 34.15,35.9 33.9,36.15 33.9,39.1 32.15,40.85 32.1,41.1 31.35,41.85 31.4,42.45 32.1,42.8 32.8,42.55 | 46.8,44.05 IC5.5 46.95,44.05 47.2,44.3 49.3,44.3 49.55,44.05 | IC5.1 44.85,40.75 45,40.6 | IC5.47 32.8,42.55 | IC5.35 36.95,48.55 v39.5,46 42.55,49.05 IC5.15 | 39.1,53.05 39,52.95 IC5.25 39,52.5 39.25,52.75 | 60.25,54.5 60.7,54.05 62.35,54.05 VIN.P$3 | v39.5,47.2 40.35,48.05 IC5.13 45.65,48.05 46.4,47.05 IC5.11 | IC1.44 38.31,23.99 38.25,24.05 38.05,24.05 v37.85,24.25
  Top 0.254: IC5.15 41.5,49.05 40.55,48.1 40.55,47 39.55,46 39.55,47.45 40.8,48.7
  other vias: 41.95,27.2 43.35,27.15 44.7,27.15 44.75,25.75 44.75,24.35 43.35,24.35 43.35,25.75 41.95,25.75 41.95,24.4 51.05,21 59.2,29.65 57.35,29.65 58.3,29.65 14.05,2.3 14.85,3.1 15.55,2.3 39.3,13.1 39.95,13.75 40.6,14.4 42.6,2.45 43.4,3.25 44.1,2.45 57.2,34.55 57.95,35.35 58.7,34.55 23.1,30.85 20.35,30.8 21.7,30.8 39.5,44.25 48.8,46.55 51.05,32.8 50,32.8 43.65,36.35 44.7,36.35 45.75,36.35 31.55,43.95 31.55,45.25 43.45,5.5 44.8,5.5 42.1,5.5 52.7,14.75 53.7,14.75 54.7,14.75 64.05,51.95 64.05,48.5 64.1,53.1 62.7,56.3 17.15,12.15 16.4,13 15.7,13.8 17.2,13.7 15.65,12.15 46.1,8.05 46.2,9.1 45.25,8.6 26.4,68.95 33.85,55.95 33.4,59.05 32.5,58.3 37.25,60.95 38.35,60.95 41.85,55 42.75,55.55 42.8,54.5 28.55,66.25 28.55,65.25 31.65,61.55 44.1,64.7 43.15,64.7 36.3,48.7 37.35,48.7 37.35,47.65 35.95,43.75 18.9,68.65 21.15,65.6 17.7,65.55 66.05,59.05 66.05,58.1 47.85,31.25 28.25,69.1 28.9,69.1 29.55,69.1 23.6,46.75 24.35,46.75 37.35,46.55 36.95,42.2 37.25,52.85 56.6,53.85 55.45,48.8 31,29.3 30.95,27.4 10.65,36.55 10.6,35.25 10.55,33.85 56,40.45 27,48.25 27,47.6 14.55,43.9 14.55,43 28.75,57 24.5,64.5 22.85,46.75 10.8,48.25 31.25,70.45 32.1,70.45 37.65,42.2 28.35,39.7 29.55,39.7 30.7,39.7 46.55,57.45 50.55,63 37.85,24.8 38.95,69.1 39.5,69.1
  pour Top (isolate 0.305): 6.95,84.1 7.55,-0.75 67.55,-0.35 68.55,84.1
  pour Bottom (isolate 0.305): 7.15,84.25 6.5,-0.35 67.75,0.25 68.4,84.25
GND1
  pour Top (isolate 0.61): -0.8,101.9 23,101.9 23,113.25 -0.8,113.3
  pour Bottom (isolate 0.61): -0.75,112.8 0,101.95 22.9,101.95 22.9,113.15 0.15,113.15
GND2
  pour Bottom (isolate 0.406): 52.45,110.75 52.45,102.3 77.5,102.3 77.5,110.7 52.5,110.7
  pour Top (isolate 0.406): 52.6,110.7 52.6,102.45 77.2,102.45 77.2,110.7
GRN
  Top 0.2: 13,16.62 LAN.G2 13.05,16.63 13.05,17.45 14.05,18.45 14.05,21.8 14.5,22.25 R16.1
N$1  (via drill 0.2)
  Top 0.2: IC1.60 R2.1 44.85,17.1 | 45.1,17.85 45.1,17.75 44.85,17.5 44.85,17.1 | 44.85,17.1 44.85,15.85 43.45,14.45 43.45,13.85 v43.4,13.8
  Bottom 0.2: XT1.1 v43.41,13.79 v43.4,13.8 43.15,13.55 C5.1
N$2  (via drill 0.2)
  Top 0.2: IC1.61 45.6,18.65 46.4,17.85 R2.2 47.1,17.1 47.4,16.8 v47.4,16.35
  Bottom 0.2: XT1.3 47.2,16 47.4,15.8 | v47.4,16.35 47.4,15.8 | 47.4,15.8 47.5,15.7 47.95,15.7 C8.1
N$3  (via drill 0.2)
  Top 0.2: IC1.50 40.1,20.15 v39.9,19.95
  Bottom 0.2: v39.9,19.95 39.6,19.95 39.3,19.7 R8.2
N$4
  Top 0.2: IC1.63 46.6,19.9 46.9,19.6 49.55,19.6 R3.2
N$5
  Top 0.2: R14.1 26.42,12.5 LAN.4
  Bottom 0.2: LAN.4 28.12,13.63 C28.1 | LAN.4 25.29,13.79 25.3,13.8 | LAN.5 24.02,12.37 LAN.4
N$6
  Top 0.2: R11.1 IC1.41
N$7  (via drill 0.2)
  Top 0.2: v45.1,32.8 IC1.21 | 43.5,32.6 v43.4,32.6 29.9,32.6 27.9,30.6 27.9,25.3 26.6,24 18.5,24 16.85,22.35 R16.2
  Bottom 0.2: v45.1,32.8 43.6,32.8 v43.4,32.6
N$8
  Top 0.2: IC1.22 44.6,32.7 44.1,33.2 29.5,33.2 27.2,30.9 27.2,25.7 26.4,24.9 17,24.9 R15.2
N$9  (via drill 0.2)
  Top 0.2: Q1.3 34.25,8.25 34.6,7.9 37.3,7.9 v37.35,7.85 | v36.95,5.6 USB1.4
  Bottom 0.2: v37.35,7.85 37.35,6 v36.95,5.6
N$10
  Top 0.2: R6.2 41.2,31.25 41.6,30.85 IC1.28
N$11
  Top 0.2: IC5.61 41.5,38.8 R21.2
N$12  (via drill 0.2)
  Top 0.2: IC5.6 43.55,44.55 v43.4,44.7
  Bottom 0.2: v43.4,44.7 43.15,44.95 R19.2
N$13
  Top 0.2: IC5.2 46.45,42.55 46.7,42.3 46.7,38.4 46.85,38.25 49.75,38.25 49.8,38.2 | XT3.1 49.8,38.2 | 49.8,38.2 C37.1
N$14
  Top 0.2: IC5.3 48.2,43.05 C38.1 48.1,42.95 XT3.3
N$15
  Bottom 0.305: H.1 62.34,109.09 62.75,109.5 70.88,109.5 OPT1.1
N$16
  Bottom 0.305: H.2 57.65,106.55 58.15,106.05 58.15,104.5 58.9,103.75 63.8,103.75 63.95,103.9 63.95,104.83 OPT1.4
N$17  (via drill 0.2)
  Top 0.2: U1.20 21.36,66.81 v21.3,66.75
  Bottom 0.2: v21.3,66.75 C33.2
N$18  (via drill 0.2)
  Top 0.2: v10.4,72.2 10.4,68.52 D1.6
  Bottom 0.2: R24.2 v10.4,72.2
N$19  (via drill 0.2)
  Top 0.2: v12.35,71.55 D1.5
  Bottom 0.2: R25.2 14.45,70.95 13.85,71.55 v12.35,71.55
N$20  (via drill 0.2)
  Top 0.254: v16,68.5 14.32,68.5 D1.4
  Bottom 0.254: R26.2 16.55,69.05 v16,68.5
N$21
  Top 0.2: Q2.3 43.6,7.55 44.2,6.95 50.5,6.95 50.85,6.6 51.85,6.6 51.95,6.5 51.95,5.85 52.45,5.35 USB2.4
N$22
  Top 0.813: V_SEN.2 18.98,106.32 17.8,107.5 13.85,107.5 PLUG.3
N$23
  Top 0.305: R22.2 ON.C
N$24
  Bottom 0.254: LAMP.2 29.18,78.88 29.7,79.4 34.4,79.4 34.8,79 Q6.3
N$25
  Bottom 0.2: OPTO.1 15.74,75.66 16.2,75.2 17.5,75.2 17.85,74.85 R39.1
N$26
  Bottom 0.254: Q6.1 38.9,78.65 39.2,78.35 R36.1 R38.2
N$27  (via drill 0.2)
  Top 0.254: v37.55,75.3 37.55,77.2 36.65,78.1 34.87,78.1 OK1.3
  Bottom 0.254: R36.2 39.2,75.55 38.95,75.3 v37.55,75.3
N$28  (via drill 0.2)
  Top 0.2: R30.1 42.95,70.75 v41.9,70.75 | v51,74.7 42.73,74.7
  Top 0.254: 42.73,74.7 OK1.1
  Bottom 0.2: v51,74.7 48.7,74.7 45.2,71.2 45.15,71.2 44.75,70.8 41.9,70.8
  Bottom 0.254: 41.9,70.8 v41.9,70.75
N$29
  Bottom 0.406: FAN.2 61.07,69.68 60.3,70.45 Q3.3
N$30
  Bottom 0.254: PWR.1 46.81,71.26 48.55,73 49.35,73 R32.1
N$31
  Top 1.27: V_SRC.2 6.73,103.78 PLUG.1
N$32
  Top 0.2: C44.1 31.15,57.05 31.5,56.7 31.85,56.7 R33.2
N$33  (via drill 0.2)
  Top 0.2: IC1.11 48.04,26.99 48.1,27 51.84,27 52.34,27.5 52.35,27.5 v52.35,28.85
  Bottom 0.2: v52.35,28.85 52.75,28.85 53.15,29.25 R4.1
RST1  (via drill 0.2)
  Top 0.2: IC2.11 55.9,9 56.05,8.85 56.05,8.2 56.2,8.05 56.8,8.05 R7.1 56.9,8.05 57.75,8.05 58.05,8.35 v58.05,10.55 58.05,12.25 RST1.TP | IC5.14 46.05,48.55 47.05,47.55 51.15,47.55 52.5,46.2 53.95,46.2 54.95,45.2 54.95,30.35 56.3,29 v56.3,27.8 | IC1.12 51.04,27.49 v51.35,27.8
  Bottom 0.2: v51.35,27.8 v56.3,27.8 59.6,27.8 60.4,27 60.4,12.15 58.6,10.35 58.25,10.35 v58.05,10.55
RST2  (via drill 0.2)
  Top 0.2: U1.29 27.61,60.74 29.3,59.05 29.3,58.1 | 29.3,58.1 C44.2 | 29.3,58.1 R42.2 27.95,56.3 RST2.TP
  Top 0.254: v25.55,65.3 27,65.3 27.55,64.75 27.55,62.34 U1.29
  Bottom 0.2: 54.55,66.3 51.19,66.31 50.85,66.65 47.15,66.65 44.7,69.1 41,69.1 39.25,67.35 39.25,64 38.9,63.65 33.15,63.65 32.8,64 32.8,67.15 31.65,68.3 27.4,68.3 26.3,67.2 26.3,66.1 v25.55,65.3
  Bottom 0.254: 25.6,65.35 v25.55,65.3 | ICSP.5 55.14,65.71 54.55,66.3
RX3
  Top 0.2: IC5.39 32.4,46.55 31.4,47.55 31.4,53.3 30.4,54.3 21.5,54.3 20.75,55.05 20.75,58.8 19.7,59.85 13.85,59.85 13.5,59.5 13.5,57.87 UART_D.3
RX_ARD
  Top 0.2: IC5.27 38,53.95 37.75,54.2 37.15,54.2 37.1,54.25 R35.2 Q5.2
RX_D
  Top 0.2: IC5.52 37,38.45 37.4,38.05 38.05,38.05 38.45,37.65 38.45,35.9 37.9,35.35 32.3,35.35 31.35,36.3 31.35,37.55 30.5,38.4 27.05,38.4 26.67,38.77 26.67,39.88 RX_4.TP 26.55,41.05 26.73,41.23 IC9.9
RX_MCU  (via drill 0.2)
  Top 0.2: U1.30 28.39,60.81 29.9,59.3 v31.7,59.3 | v39.65,61.8 Q4.3
  Bottom 0.2: R40.2 42.6,61.8 v39.65,61.8 34.45,61.8 31.95,59.3 v31.7,59.3
RX_T  (via drill 0.2)
  Top 0.2: IC2.4 47.52,10.27 v47.3,10.05 47.4,9.95 TX_1.TP | v63.7,16.15 64.6,17.05 64.6,41.05 62.95,42.7 57.55,42.7 55.8,44.45 55.8,45.15 54,46.95 52.75,46.95 51.5,48.2 47.3,48.2 45.95,49.55 IC5.16
  Bottom 0.2: v63.7,16.15 63.7,12.1 58.45,6.85 55.1,6.85 53.25,8.7 48.35,8.7 47.3,9.75 v47.3,10.05
RXN
  Top 0.2: IC1.53 41.6,19 41.3,18.7 26.4,18.7 25.4,19.7 21.9,19.7 20.7,18.5 20.7,16.5 21,16.2 23.75,16.2 24.1,15.85 24.1,12.29 LAN.6 25.69,10.7 26.6,10.7 27.2,10.1 R9.1
  Bottom 0.2: LAN.6 C24.1
RXP
  Top 0.2: IC1.52 41.1,19.4 40.9,19.2 33.9,19.2 | 33.9,19.2 26.8,19.2 25.7,20.3 21.6,20.3 20.1,18.8 20.1,15.4 20.6,14.9 LAN.3 | R10.1 33.9,19.2
  Bottom 0.2: C25.1 LAN.3 22.7,14.9 22.6,14.8 22.7,14.8 22.8,14.9
S1A
  Top 0.2: IC9.4 25.12,43.83 25.45,44.15 25.45,47.75 27.15,49.45 27.15,50.01 UART_5V.4
S1B  (via drill 0.2)
  Top 0.2: v26.4,43.8 27.98,43.8 IC9.13
  Bottom 0.2: UART_5V.5 25.9,51.3 25.9,44.3 v26.4,43.8
S2A
  Top 0.2: UART_5V.6 24.65,50.01 24.65,48.85 23.55,47.75 21.35,47.75 20.9,47.3 19.75,47.3 19.15,46.7 19.15,44.35 20.33,43.17 IC9.5
S2B
  Top 0.2: UART_5V.3 28.45,51.3 28.45,48.45 30.6,46.3 30.6,43.75 30,43.15 28.02,43.15 IC9.12
S3A
  Top 0.2: IC9.6 20.02,42.52 17.6,44.95 16.6,44.95 16,45.55 16,50.01 UART_3V.4
S3B  (via drill 0.2)
  Top 0.2: v25.9,42.5 27.98,42.5 IC9.11 | v14.75,50.65 14.75,51.3 UART_3V.3
  Bottom 0.2: UART_3V.3 16.02,52.53 | v25.9,42.5 24.7,43.7 18.15,43.7 17.3,44.55 17.3,46.1 14.75,48.65 v14.75,50.65
S4A
  Top 0.2: IC9.7 19.62,41.88 17.55,43.95 16.3,43.95 14.95,45.3 14.95,48.56 UART_3V.6 13.45,50
S4B  (via drill 0.2)
  Top 0.2: v25.25,41.9 27.98,41.9 IC9.10
  Bottom 0.2: v25.25,41.9 24.1,43.05 17.4,43.05 16.3,44.15 16.3,46.1 14.65,47.75 13.1,47.75 12.2,48.65 12.2,51.29 UART_3V.5
SCL  (via drill 0.2)
  Top 0.2: U1.28 26.79,60.66 v27.15,60.3
  Bottom 0.2: 27.15,61.85 27.5,62.2 27.5,66.7 28.1,67.3 30.8,67.3 31.55,66.55 31.55,63.05 32.15,62.45 39.35,62.45 40.35,63.45 40.35,66.7 41.45,67.8 43.95,67.8 46.15,65.6 50.35,65.6 50.65,65.3 51.5,65.3 52.7,64.1 52.7,62.85 53.05,62.5 59.65,62.5 61,63.85 I2C.2 | R27.2 v27.15,60.3 27.15,61.85 | 26.4,61.85 27.15,61.85
  Bottom 0.254: 26.4,61.85 IC6.4
SDA  (via drill 0.2)
  Top 0.2: U1.27 26.01,60.76 v25.55,60.3
  Bottom 0.2: R23.2 v25.55,60.3 24.9,60.95 24.9,63.45 25.3,63.85 IC6.5 26.8,63.85 26.8,66.8 27.8,67.8 31.25,67.8 32.15,66.9 32.15,63.25 32.4,63 39.2,63 39.8,63.6 39.8,67 41.25,68.45 44.35,68.45 46.7,66.1 50.6,66.1 50.9,65.8 51.9,65.8 53.3,64.4 53.3,63.2 53.45,63.05 59.2,63.05 59.7,63.55 59.7,64.35 61.74,66.39 I2C.1
T2_USBD+  (via drill 0.2)
  Top 0.2: IC2.8 49.1,7.75 50.8,7.75 51.5,7.05 52.25,7.05 52.6,6.7 v52.6,6 | v51.8,5.25 USB2.3
  Bottom 0.2: v52.6,6 v51.8,5.25
T2_USBD-  (via drill 0.2)
  Top 0.2: IC2.9 54.49,7.75 53.7,7.75 53.5,7.55 53.5,6 v53.4,5.8 | v51.15,5.75 USB2.2
  Bottom 0.2: v51.15,5.75 50.9,6 50.9,6.4 51.05,6.55 52.85,6.55 53.4,6 v53.4,5.8
TX3  (via drill 0.2)
  Top 0.2: IC5.38 32.65,47.05 31.95,47.75 31.95,53.45 30.6,54.8 22,54.8 21.4,55.4 21.4,59 19.85,60.55 v16.1,60.55
  Bottom 0.2: v16.1,60.55 16.1,57.93 UART_D.2
TX_ARD
  Top 0.2: Q4.2 40.55,57.85 40.55,57.2 40.35,57 R34.2 40.35,53.8 40.1,53.55 38.8,53.55 38.5,53.25 IC5.26
TX_D  (via drill 0.2)
  Top 0.2: 24.05,41.1 23.92,41.23 IC9.8 | 24.05,41.1 24.05,40.05 TX_4.TP | IC5.48 v31.95,42.05 | v24.7,41.1 24.05,41.1
  Bottom 0.2: v31.95,42.05 31,41.1 v24.7,41.1
TX_MCU  (via drill 0.2)
  Top 0.2: U1.31 29.21,61.04 30.2,60.05 Q5.3 v37.75,60.05
  Bottom 0.2: v37.75,60.05 38.6,60.05 38.9,60.35 R41.2 42.55,60.3 42.55,60.05
TX_T  (via drill 0.2)
  Top 0.2: IC2.1 49.05,12.2 48.15,12.2 48.05,12.3 48.05,13 48.1,13.05 v50.6,13.05 50.8,13.25 RX_1.TP | v62.55,15.25 62.75,15.45 64.15,15.45 65.1,16.4 65.1,41.4 63.3,43.2 58.05,43.2 56.35,44.9 56.35,45.6 56,45.95 54.35,47.6 52.9,47.6 51.7,48.8 47.8,48.8 46.25,50.35
  Top 0.254: IC5.17 43,52.45 43.3,52.75 45.85,52.75 46.25,52.35 46.25,50.35
  Bottom 0.2: v50.6,13.05 51,12.65 51,9.55 51.3,9.25 53.9,9.25 55.45,7.7 58.15,7.7 62.55,12.1 v62.55,15.25
TXN
  Top 0.2: IC1.56 43.1,18.4 42.3,17.6 25.9,17.6 25.3,17 LAN.2 26.77,14.7 R12.1
  Bottom 0.2: LAN.2 28.12,16.18 C26.1
TXP
  Top 0.2: IC1.55 42.6,18.7 42.1,18.2 23.51,18.2 LAN.1
  Bottom 0.2: C27.1 22.75,19.9 LAN.1 23.3,18 R13.1
USB0_D+  (via drill 0.2)
  Top 0.2: v37.95,8.75 37.95,13.55 40.5,16.1 42.6,16.1 44.35,17.85 44.35,19.15 44.6,19.4 IC1.59 | USB1.3 v36.3,6.25
  Bottom 0.2: v37.95,8.75 37.15,8.75 36.3,7.9 v36.3,6.25
USB0_D-  (via drill 0.2)
  Top 0.2: IC1.58 44.1,19.9 43.7,19.5 43.7,18 42.5,16.8 40.3,16.8 36.95,13.45 v36.95,9.95 | USB1.2 v35.65,5.45
  Bottom 0.2: v35.65,5.45 35.65,8.65 v36.95,9.95
USB1_D+
  Top 0.2: IC1.2 55.86,22.49 USB_PORTS.6
USB1_D-
  Top 0.2: IC1.1 52.46,21.99 53.4,21.05 53.4,20.4 53.9,19.9 55.85,19.9 USB_PORTS.4
USB2_D+
  Top 0.2: IC1.4 53.79,23.49 54.6,24.3 54.6,25.65 55.25,26.3 56.8,26.3 57.1,26 57.1,24.25 58.15,23.2 58.15,22.74 USB_PORTS.5
USB2_D-
  Top 0.2: IC1.3 54.49,22.99 55.3,23.8 56.4,23.8 57.1,23.1 57.1,21.25 USB_PORTS.3
USB3_D+
  Top 0.2: IC1.7 52.49,24.99 54.05,26.55 54.05,31.6 53.25,32.4 53.25,44.45 52.15,45.55 IC5.8
USB3_D-  (via drill 0.2)
  Top 0.2: IC1.6 47.95,24.5 52.8,24.5 54.5,26.2 54.5,31.95 53.85,32.6 v53.85,45 | v51.45,45.05 IC5.7
  Bottom 0.2: v53.85,45 51.5,45 v51.45,45.05
USB4_D+
  Top 0.2: IC1.9 51.89,25.99 53.05,27.15 53.05,30.85 52.2,31.7 52.2,33.5 51.75,33.95 28.95,33.95 28.3,33.3 USB_E.3
USB4_D-
  Top 0.2: IC1.8 52.2,25.5 53.55,26.85 53.55,31.2 52.7,32.05 52.7,33.8 51.8,34.7 28.95,34.7 28.35,35.3 USB_E.2
USB_PLL
  Top 0.2: IC1.62 46.1,19.5 46.6,19 48.4,19 48.8,18.6 48.8,18.59 R5.1 C19.1
VCCIO  (via drill 0.2, 0.5)
  Top 0.2: R42.1 v26.65,56.75 | v43.9,59.1 43.9,59.05 42.65,59.05 42.3,59.4 42.3,62.2 42.65,62.55 IC3.5 | v15.55,73.45 15.55,74 16.1,74.55 17.55,74.55 18.05,75.05 | 18.05,75.05 18.05,78.7 18.75,79.4 24.8,79.4 25.25,78.95 25.25,77.06 PIR.1 | C39.1 53.15,63.95 53.1,63.9 | C40.1 33.35,67.45 33.2,67.6 | 18.05,75.05 19.4,75.05 20,74.45 20.65,74.45 20.85,74.25 20.85,72.1 20,71.25 20,68.75 20.34,68.41 U1.18
  Top 0.254: U1.4 v29.81,65.99 v29.8,66 | R31.1 51.15,65 51.5,64.65 v51.5,63.9
  Top 0.406: U1.4 33.45,65.99 | SW1.2 SW1.5 v51.5,63.9 53.1,63.9 59.25,63.9 60.1,64.75 60.1,70.9 | 33.45,65.99 33.2,66.24 33.2,67.6 33.19,67.59 U1.6 25.05,67.6 24.24,68.41 U1.18 | 33.45,65.99 40.64,65.99 v41.35,66.7 | 62.6,76.96 SL6.1 62.2,76.56 62.2,75.65 60.1,73.55 60.1,70.9 | ICSP.2 59.99,70.79 60.1,70.9
  Bottom 0.2: v26.65,56.75 27,56.75 27.15,56.9 R27.1 | v43.9,59.1 R41.1 | R39.2 v15.55,73.45 R37.1
  Bottom 0.254: R41.1 R40.1 45.1,61.55 45.65,62.1 45.65,64.9 45.6,65 | R23.1 R27.1 28.2,57.9 28.65,58.35 29.75,58.35 30.3,58.9 30.3,62 | IC6.3 30.25,61.95 30.3,62 | v29.8,66 30.5,66 30.9,65.6 30.9,62.6 30.3,62
  Bottom 0.406: v41.35,66.7 43.9,66.7 45.6,65 | v51.5,63.9 51.5,64.15 51.05,64.6 50.15,64.6 49.85,64.9 45.65,64.9
VPHY  (via drill 0.2)
  Top 0.2: v43.6,43.55 IC5.4
  Bottom 0.2: 42.2,43.55 v43.6,43.55 | C36.1 42.2,43.55 | 42.2,43.55 R20.1 42.1,41.95 C35.1
VPLL  (via drill 0.2)
  Top 0.2: IC5.9 43.5,46.05 43.35,46.2 v43.35,46.7
  Bottom 0.2: C32.1 42,48.5 R17.1 42.2,46.95 | 42.2,46.95 C30.1 | 42.2,46.95 43.1,46.95 v43.35,46.7
X0_ARD  (via drill 0.2)
  Top 0.2: U1.7 33.04,68.41 v33.1,68.55
  Bottom 0.2: 34.25,66.25 34.25,65.3 C31.1 | R18.1 37.7,66.65 37.3,66.25 34.25,66.25 | 34.25,66.25 34.45,66.45 XT2.1 33.95,67.7 v33.1,68.55
X1_ARD  (via drill 0.2)
  Top 0.2: U1.8 32.79,69.19 33.45,69.85 v37.7,69.85
  Bottom 0.2: XT2.3 36,69.85 v37.7,69.85 R18.2
  Bottom 0.254: C34.1 38.25,70.4 v37.7,69.85
YEL
  Top 0.2: LAN.Y2 11.5,17.15 13,18.65 13,23.25 14.6,24.85 R15.1

## Text on the board
tPlace: 13 | 12 | 11 | 7 | 6 | 5 | GND | VCC | 3.3v | 5V | 5V Vt GND